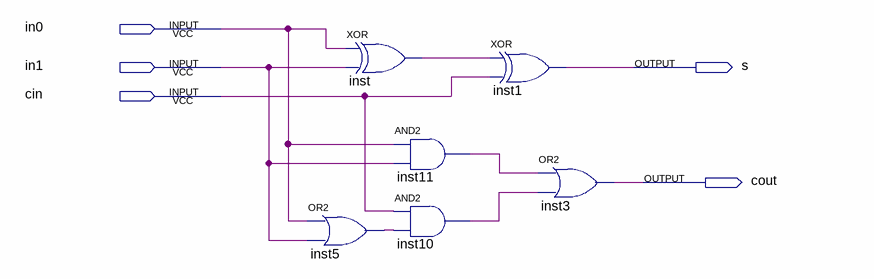
[diagram p0: schematic sheet]
// Quartus schematic FullAdder.bdf as structural Verilog: 6 symbols, 5 pins
module FullAdder (
  input  in0,
  input  in1,
  input  cin,
  output s,
  output cout
);

  wire inst5_out, inst10_out, inst11_out, inst_out;

  xor inst (inst_out, in0, in1);
  or inst5 (inst5_out, in0, in1);
  and inst11 (inst11_out, in0, in1);
  and inst10 (inst10_out, cin, inst5_out);
  xor inst1 (s, inst_out, cin);
  or inst3 (cout, inst11_out, inst10_out);
endmodule
